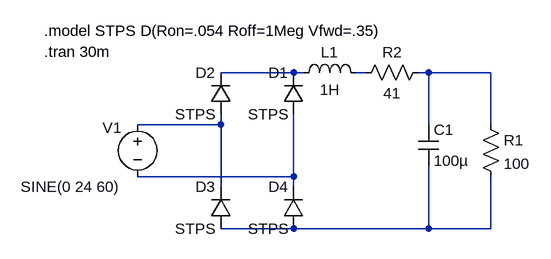
[diagram p0: schematic RectifierLC100O.asc]
RectifierLC100O.asc, the LTspice schematic file:
Version 4.1
SHEET 1 880 680
WIRE 240 32 128 32
WIRE 256 32 240 32
WIRE 352 32 336 32
WIRE 448 32 432 32
WIRE 544 32 448 32
WIRE 128 112 128 96
WIRE 128 112 0 112
WIRE 448 112 448 32
WIRE 544 112 544 32
WIRE 240 192 240 96
WIRE 240 192 0 192
WIRE 128 208 128 112
WIRE 240 208 240 192
WIRE 240 272 128 272
WIRE 448 272 448 176
WIRE 448 272 240 272
WIRE 544 272 544 192
WIRE 544 272 448 272
SYMBOL voltage 0 96 R0
WINDOW 0 -54 21 Left 2
WINDOW 3 -180 112 Left 2
WINDOW 123 0 0 Left 0
WINDOW 39 0 0 Left 0
SYMATTR InstName V1
SYMATTR Value SINE(0 24 60)
SYMBOL res 528 96 R0
SYMATTR InstName R1
SYMATTR Value 100
SYMBOL diode 256 96 R180
WINDOW 0 24 64 Left 2
WINDOW 3 24 0 Left 2
SYMATTR InstName D1
SYMATTR Value STPS
SYMBOL diode 144 96 R180
WINDOW 0 24 64 Left 2
WINDOW 3 24 0 Left 2
SYMATTR InstName D2
SYMATTR Value STPS
SYMBOL diode 144 272 R180
WINDOW 0 24 64 Left 2
WINDOW 3 24 0 Left 2
SYMATTR InstName D3
SYMATTR Value STPS
SYMBOL diode 256 272 R180
WINDOW 0 24 64 Left 2
WINDOW 3 24 0 Left 2
SYMATTR InstName D4
SYMATTR Value STPS
SYMBOL cap 432 112 R0
SYMATTR InstName C1
SYMATTR Value 100µ
SYMBOL ind 240 48 R270
WINDOW 0 32 56 VTop 2
WINDOW 3 5 56 VBottom 2
SYMATTR InstName L1
SYMATTR Value 1H
SYMBOL res 336 48 R270
WINDOW 0 32 56 VTop 2
WINDOW 3 0 56 VBottom 2
SYMATTR InstName R2
SYMATTR Value 41
TEXT -144 -32 Left 2 !.model STPS D(Ron=.054 Roff=1Meg Vfwd=.35)
TEXT -144 0 Left 2 !.tran 30m

The netlist it stands for:
* RectifierLC100O.asc
V1 N004 N005 SINE(0 24 60)
R1 N003 N006 100
D1 N005 N001 STPS
D2 N004 N001 STPS
D3 N006 N004 STPS
D4 N006 N005 STPS
C1 N003 N006 100µ
L1 N001 N002 1H
R2 N002 N003 41
.model D D
.lib standard.dio
.model STPS D(Ron=.054 Roff=1Meg Vfwd=.35)
.tran 30m
.backanno
.end